# EasyEDA Pro project Motores.epro, board PCB2
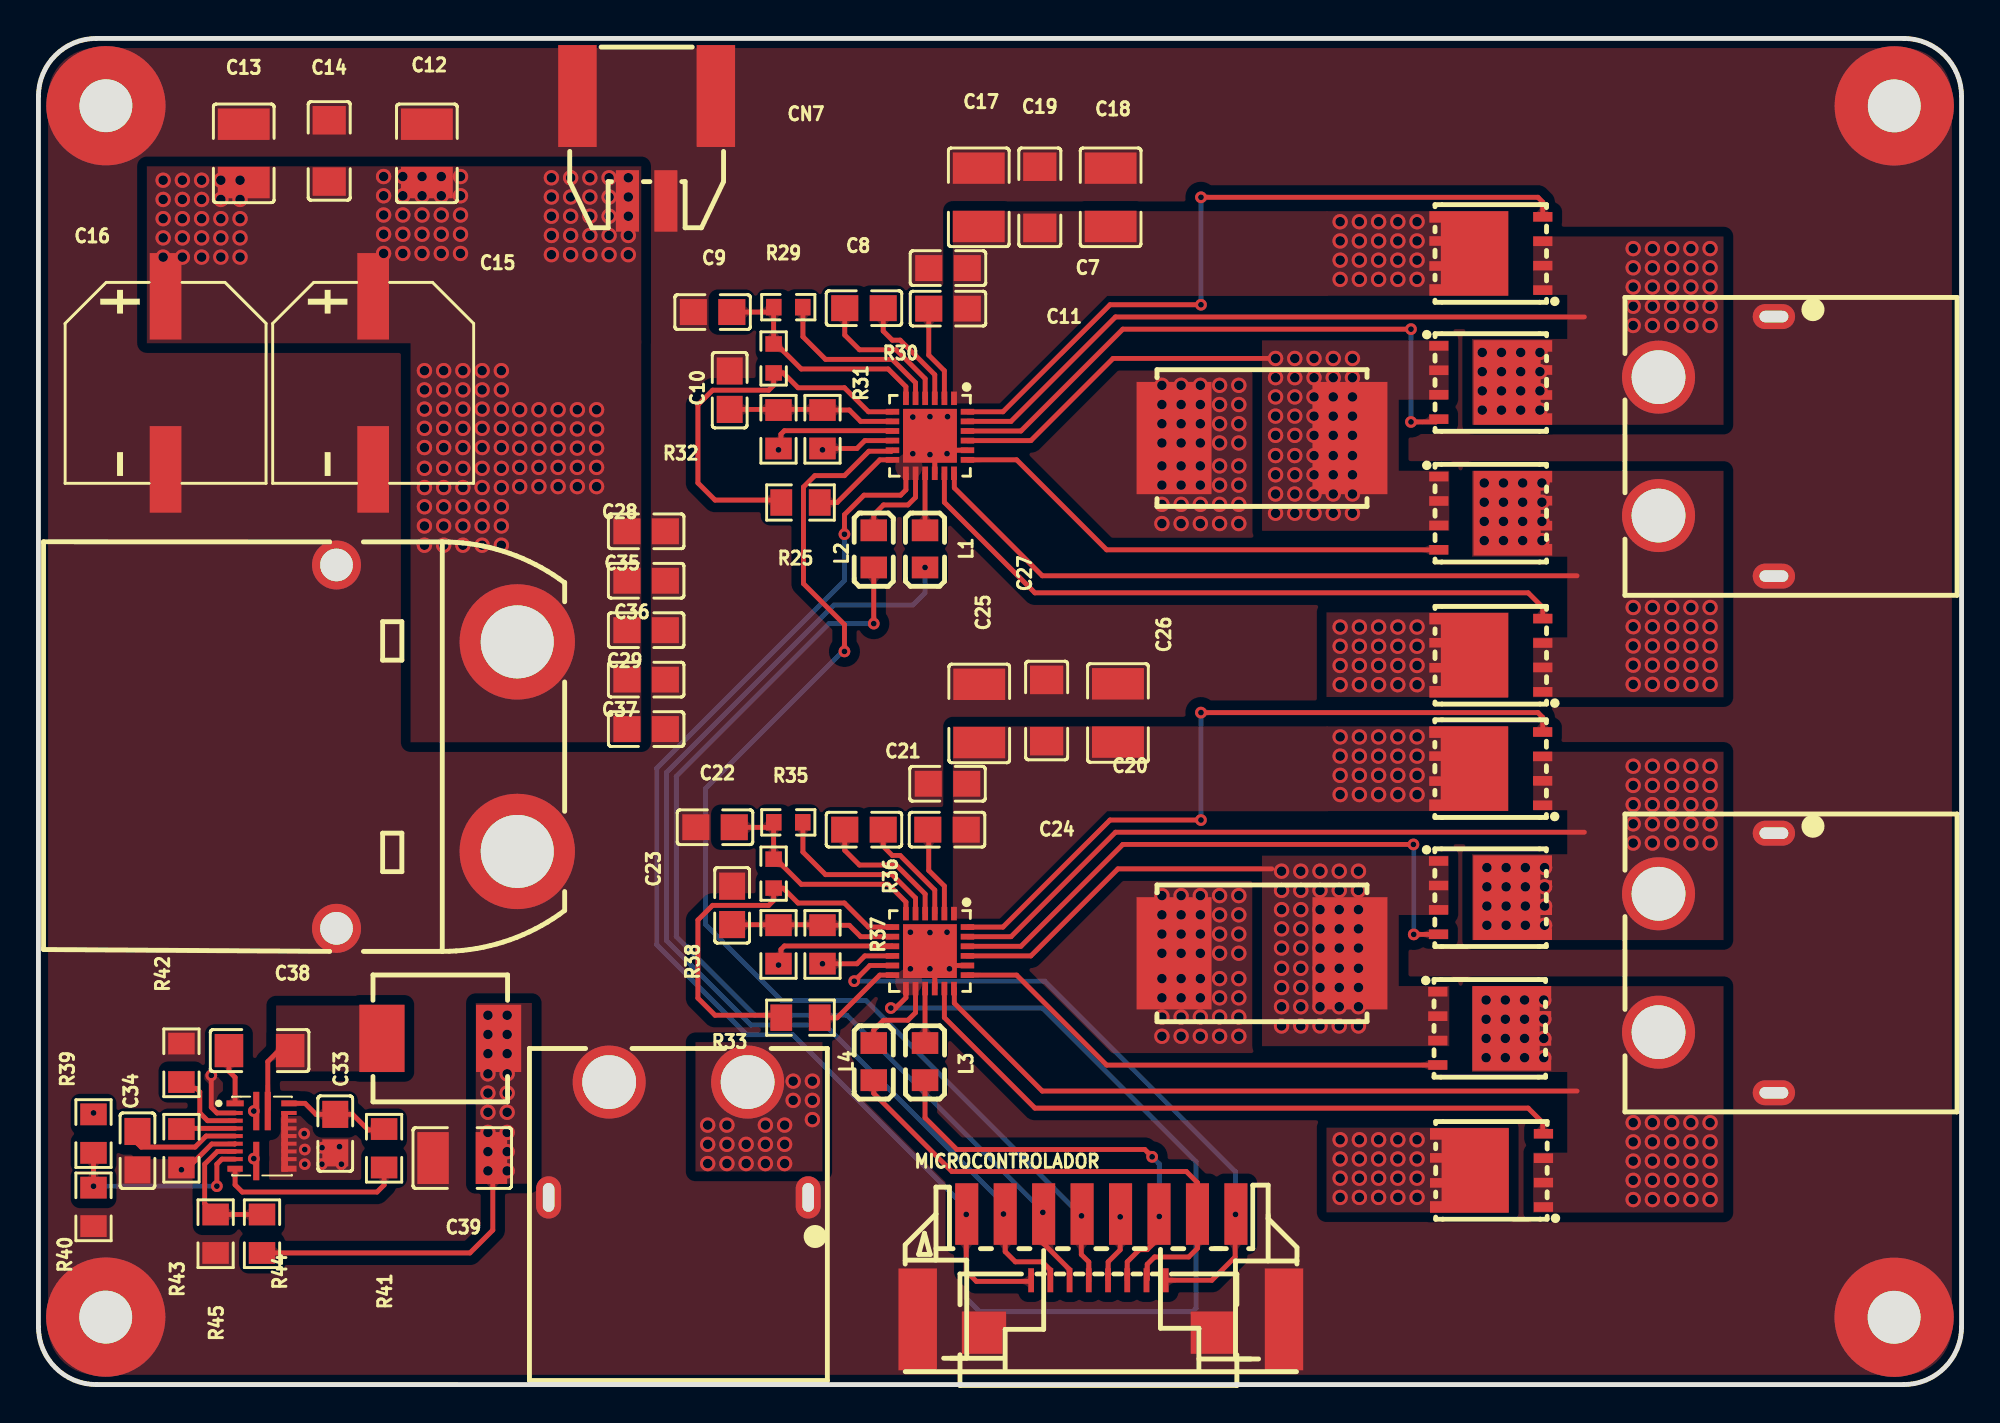
[diagram p1: board, top side]
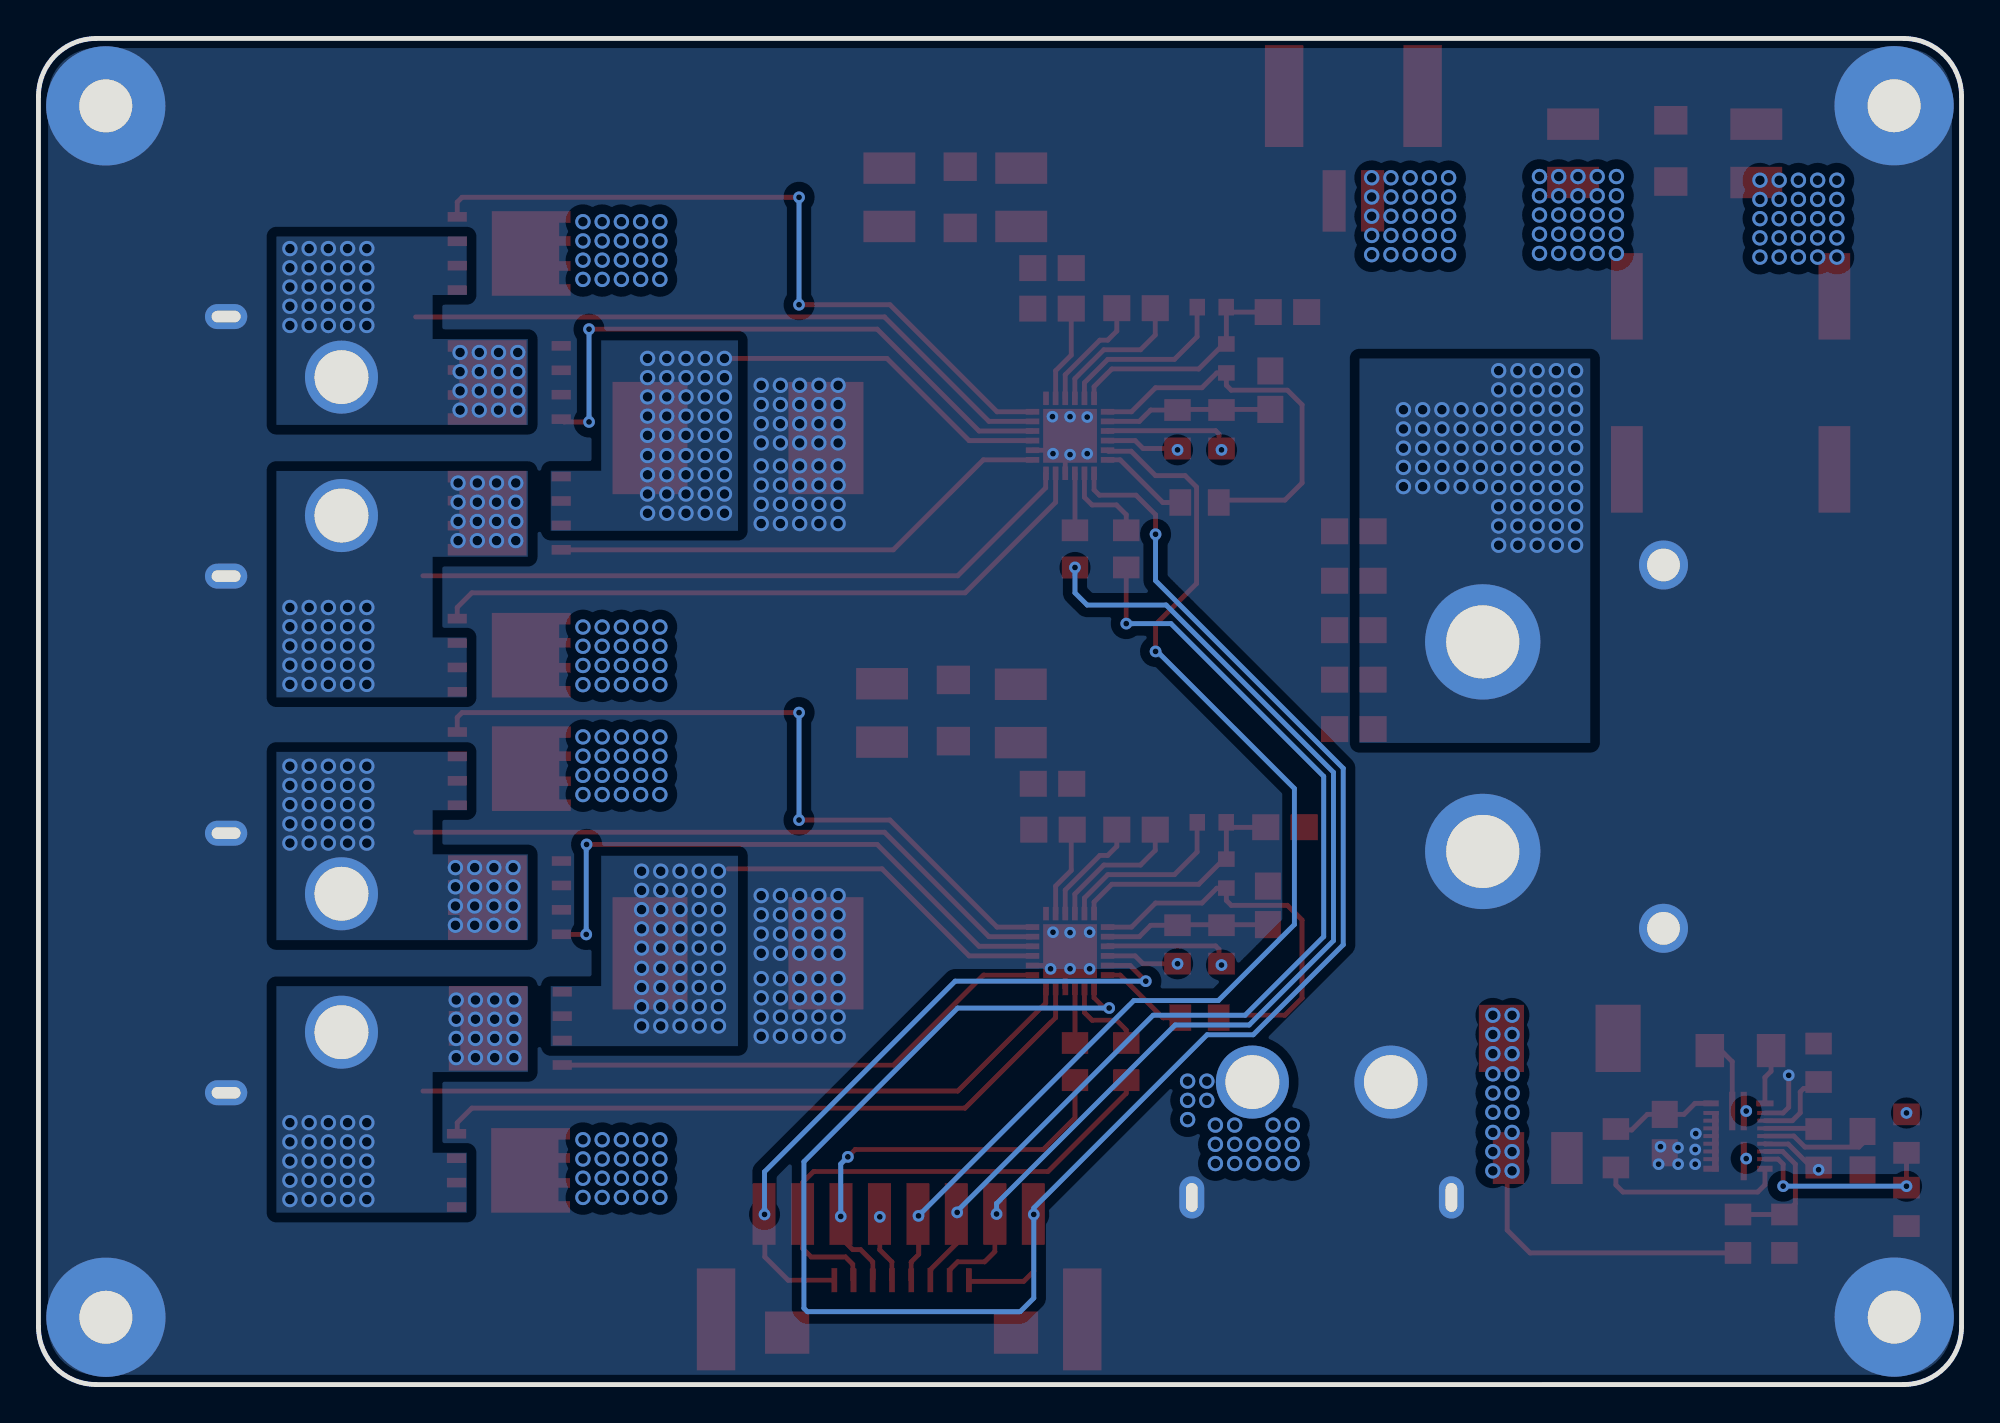
[diagram p2: board, bottom side, seen from below]

Outline 100.02 x 70.02 mm; copper layers: Top Layer, GND, PWR, Bottom Layer. Coordinates in mm from the lower left corner of the outline.
Outline path: 0,67.02 arc(0.88,69.14) 3.01,70.02 97.02,70.02 arc(99.14,69.13) 100.02,67.01 100.02,3 arc(99.13,0.88) 97.01,0 3,0 arc(0.88,0.88) 0,3.01 0,67.02
Stack: Top Layer 0.035mm Outer layer thickness 1oz / Dielectric1 0.2104mm 7628 RC49% 8.6mil / GND 0.0152mm Inner layer thickness / Dielectric2 1.065mm 1.1mm H/HOZ Copper / PWR 0.0152mm Inner layer thickness / Dielectric3 0.2104mm 7628 RC49% 8.6mil / Bottom Layer 0.035mm Outer layer thickness 1oz

## Design rules (mm)
template: Custom Config
spacing copperThickness1oz (default): track to track 0.102, other pairs 0.152 to 0.3
spacing copperThickness2oz: track to track 0.203, other pairs 0.152 to 0.3
track width copperThickness1oz (default): min 0.127, default 0.254, max 3
track width copperThickness2oz: min 0.203, default 0.254, max 2.54
differential pair differentialPair (default): width min 0.127, default 0.254, max 2.54; gap min 0.152, default 0.152
via viaSize (default): diameter min 0.5, default 0.61, max 10; hole min 0.3, default 0.305, max 6.3

## Placement (name value [footprint] x y rotation side)
C7  100nF  [C0805]  47.3 58.07 180 top
C8  100nF  [C0805]  42.93 55.99 180 top
C9  1uF  [C0805]  35.06 55.79 0 top
C10  1uF  [C0805]  35.95 51.72 270 top
C11  1uF  [C0805]  47.3 55.96 0 top
C12  22uF  [C1210]  20.2 64.04 90 top
C13  22uF  [C1210]  10.68 64.04 90 top
C14  100nF  [C1206]  15.12 64.17 270 top
C15  1000uF  [CAP-SMD_BD10.0-L10.3-W10.3-FD]  17.41 52.1 270 top
C16  1000uF  [CAP-SMD_BD10.0-L10.3-W10.3-FD]  6.61 52.1 270 top
C17  22uF  [C1210]  48.9 61.76 90 top
C18  22uF  [C1210]  55.76 61.76 90 top
C19  100nF  [C1206]  52.08 61.76 270 top
C20  100nF  [C0805]  47.28 31.25 180 top
C21  100nF  [C0805]  42.93 28.86 180 top
C22  1uF  [C0805]  35.19 28.99 0 top
C23  1uF  [C0805]  36.08 24.93 270 top
C24  1uF  [C0805]  47.25 28.86 0 top
C25  22uF  [C1210]  48.93 34.91 90 top
C26  22uF  [C1210]  56.14 34.93 90 top
C27  100nF  [C1206]  52.43 35.06 270 top
C28  4.7uF  [C0805]  31.61 44.38 180 top
C29  4.7uF  [C0805]  31.61 36.67 180 top
C33  2.2uF  [C0805]  15.44 13.05 90 top
C34  82nF  [C0805]  5.15 12.16 90 top
C35  1uF  [C0805]  31.61 41.81 180 top
C36  1uF  [C0805]  31.61 39.24 180 top
C37  1uF  [C0805]  31.61 34.09 180 top
C38  100nF  [C1206]  11.5 17.37 180 top
C39  100uF  [C1210]  22.04 11.78 0 top
CN6  BATERIA  [CONN-TH_XT90PW-M.G.Y]  20.2 33.18 90 top
CN7  5023520201  [CONN-SMD_2P-P2.00_MOLEX_5023520201]  31.63 64.3 180 top
FPC1  AFA01-S08FCA-00  [FPC-SMD_8P-P1.00_FGS-XJ-H2.0]  55.13 4.06 180 top
L1  BLM21RK221SN1D  [L0805]  46.11 43.47 90 top
L2  BLM21RK221SN1D  [L0805]  43.44 43.47 90 top
L3  BLM21RK221SN1D  [L0805]  46.11 16.8 90 top
L4  BLM21RK221SN1D  [L0805]  43.44 16.8 90 top
MICROCONTROLADOR  5023520800  [CONN-SMD_5023520800]  55.25 6.13 0 top
NOREF  -  [Pad_e746]  96.51 3.5 180 top
NOREF#2  -  [Pad_e748]  3.5 3.51 90 top
NOREF#3  -  [Pad_e744]  96.52 66.51 270 top
NOREF#4  -  [Pad_e742]  3.51 66.52 0 top
Q10  BSC014N06NS  [POWERVDFN-8_L6.2-W5.2-P1.27-LS6.0-BL]  76.46 58.83 90 top
Q11  BSC014N06NS  [POWERVDFN-8_L6.2-W5.2-P1.27-LS6.0-BL]  74.6 52.12 270 top
Q12  BSC014N06NS  [POWERVDFN-8_L6.2-W5.2-P1.27-LS6.0-BL]  74.6 45.32 270 top
Q13  BSC014N06NS  [POWERVDFN-8_L6.2-W5.2-P1.27-LS6.0-BL]  76.46 37.94 90 top
Q14  BSC014N06NS  [POWERVDFN-8_L6.2-W5.2-P1.27-LS6.0-BL]  76.46 32.04 90 top
Q15  BSC014N06NS  [POWERVDFN-8_L6.2-W5.2-P1.27-LS6.0-BL]  74.59 25.33 270 top
Q16  BSC014N06NS  [POWERVDFN-8_L6.2-W5.2-P1.27-LS6.0-BL]  74.55 18.53 270 top
Q17  BSC014N06NS  [POWERVDFN-8_L6.2-W5.2-P1.27-LS6.0-BL]  76.5 11.14 90 top
R25  68kΩ  [R0805]  39.63 45.88 0 top
R26  5mΩ  [RES-SMD_L11.6-W7.0_WSR5]  63.64 49.23 0 top
R29  56kΩ  [R0603]  39 56.04 0 top
R30  44.2kΩ  [R0603]  38.23 53.37 90 top
R31  10kΩ  [R0805]  40.77 49.69 90 top
R32  10kΩ  [R0805]  38.49 49.69 90 top
R33  68kΩ  [R0805]  39.63 19.08 0 top
R34  5mΩ  [RES-SMD_L11.6-W7.0_WSR5]  63.64 22.43 0 top
R35  56kΩ  [R0603]  39 29.24 0 top
R36  44.2kΩ  [R0603]  38.23 26.58 90 top
R37  10kΩ  [R0805]  40.77 22.89 90 top
R38  10kΩ  [R0805]  38.49 22.89 90 top
R39  66.5kΩ  [R0805]  2.86 13.05 90 top
R40  10kΩ  [R0805]  2.86 9.24 90 top
R41  30.1kΩ  [R0805]  17.98 12.29 90 top
R42  4.87kΩ  [R0805]  7.44 16.74 270 top
R43  30.1kΩ  [R0805]  7.44 12.29 90 top
R44  45.3kΩ  [R0805]  11.63 7.85 270 top
R45  10kΩ  [R0805]  9.21 7.85 90 top
U13  DRV8701PRGER  [VQFN-24_L4.0-W4.0-P0.50-BL-EP2.8]  46.37 49.35 180 top
U16  DRV8701PRGER  [VQFN-24_L4.0-W4.0-P0.50-BL-EP2.8]  46.36 22.55 180 top
U17  MOTOR IZQUIERDO  [TH_2P-XT60PW-F]  87.26 48.8 270 top
U18  MOTOR DERECHO  [TH_2P-XT60PW-F]  87.26 21.93 270 top
U19  TPS54JA20RWWR  [TQFN-21_L4.0-W3.0-P0.40-TL_MPQ8633BGLE-Z]  11.63 12.93 0 top
U20  1.2uH  [IND-SMD_L7.0-W6.6_0630CDMCCDS]  20.9 18.01 0 top
U21  SALIDA 5V  [TH_2P-XT60PW-F]  33.28 12.73 180 top

## Footprints (pads in the part's own frame, mm; a bottom-side part is the same pattern mirrored in y, then rotated)
C0805
  rect 1.41x1.35 smd: 1(-1,0) 2(1,0)
C1206
  rect 1.485x1.728 smd: 1(-1.593,0) 2(1.593,0)
C1210
  rect 1.635x2.7 smd: 1(-1.518,0) 2(1.518,0)
CAP-SMD_BD10.0-L10.3-W10.3-FD
  rect 4.5x1.65 smd: 1(-4.5,0) 2(4.5,0)
CONN-SMD_2P-P2.00_MOLEX_5023520201
  rect 1.2x3.2 smd: 1(1,2.728) 2(-1,2.728)
  rect 2x5.3 smd: 3(-3.6,-2.728) 4(3.6,-2.728)
CONN-SMD_5023520800
  rect 1.2x3.2 smd: 1(-6.975,2.74) 2(-4.975,2.74) 3(-2.975,2.74) 4(-0.975,2.74) 5(1.025,2.74) 6(3.025,2.74) 7(5.025,2.74) 8(7.025,2.74)
  rect 2x5.3 smd: 9(9.525,-2.74) 10(-9.525,-2.74)
CONN-TH_XT90PW-M.G.Y
  round 6 hole 3.8: 1(-5.45,-4.7) 2(5.45,-4.7)
  round 2.55 hole 1.7: 3(9.45,4.7) 4(-9.45,4.7)
FPC-SMD_8P-P1.00_FGS-XJ-H2.0
  rect 0.3x1.25 smd: 1(-3.5,-1.363) 2(-2.5,-1.363) 3(-1.5,-1.363) 4(-0.5,-1.363) 5(0.5,-1.363) 6(1.5,-1.363) 7(2.5,-1.363) 8(3.5,-1.363)
  rect 2.3x2.2 smd: 9(-5.95,1.363) 10(5.95,1.363)
IND-SMD_L7.0-W6.6_0630CDMCCDS
  rect 2.35x3.5 smd: 1(-3.035,0) 2(3.035,0)
L0805
  rect 1.133x1.377 smd: 1(-0.966,0) 2(0.966,0)
Pad_e742
  round 6.2 hole 2.75: 2(0,0)
Pad_e744
  round 6.2 hole 2.75: 2(0,0)
Pad_e746
  round 6.2 hole 2.75: 2(0,0)
Pad_e748
  round 6.2 hole 2.75: 2(0,0)
POWERVDFN-8_L6.2-W5.2-P1.27-LS6.0-BL
  rect 0.5x1 smd: 1(-1.905,-1.775) 2(-0.635,-1.775) 3(0.635,-1.775) 4(1.905,-1.775)
  custom 4.4x4.1 smd: 5(0,1.775)
R0603
  rect 0.806x0.864 smd: 1(-0.753,0) 2(0.753,0)
R0805
  rect 1.133x1.377 smd: 1(-1,0) 2(1,0)
RES-SMD_L11.6-W7.0_WSR5
  rect 3.9x5.84 smd: 1(-4.575,0) 2(4.575,0)
TH_2P-XT60PW-F
  oval 1.3x2.2 hole 0.6x1.5: 1(-6.75,3) 2(6.75,3)
  round 3.8 hole 2.8: 3(-3.6,-3) 4(3.6,-3)
TQFN-21_L4.0-W3.0-P0.40-TL_MPQ8633BGLE-Z
  rect 0.9x0.31 smd: 1(-1.4,1.7)
  rect 0.8x0.21 smd: 2(-1.4,1.2) 3(-1.4,0.8) 4(-1.4,0.4) 5(-1.4,0) 6(-1.4,-0.4) 7(-1.4,-0.8) 8(-1.4,-1.2) 12(1.4,-1.2) 13(1.4,-0.8) 14(1.4,-0.4) 15(1.4,0) 16(1.4,0.4) 17(1.4,0.8) 18(1.4,1.2)
  rect 0.8x0.31 smd: 9(-1.4,-1.7) 11(1.4,-1.7) 19(1.4,1.7)
  rect 0.32x2 smd: 10(-0.3,-1.3) 20(0.3,1.3) 21(-0.3,1.3)
  rect 0.35x3.15 smd: 11(1.175,-0.275)
VQFN-24_L4.0-W4.0-P0.50-BL-EP2.8
  rect 0.3x0.7 smd: 1(-1.25,-1.95) 2(-0.75,-1.95) 3(-0.25,-1.95) 4(0.25,-1.95) 5(0.75,-1.95) 6(1.25,-1.95) 13(1.25,1.95) 14(0.75,1.95) 15(0.25,1.95) 16(-0.25,1.95) 17(-0.75,1.95) 18(-1.25,1.95)
  rect 0.7x0.3 smd: 7(1.95,-1.25) 8(1.95,-0.75) 9(1.95,-0.25) 10(1.95,0.25) 11(1.95,0.75) 12(1.95,1.25) 19(-1.95,1.25) 20(-1.95,0.75) 21(-1.95,0.25) 22(-1.95,-0.25) 23(-1.95,-0.75) 24(-1.95,-1.25)
  rect 2.8x2.8 smd: 25(0,0)

## Nets
As in the schematic, except:
GND: C7.2 C9.1 C10.1 C12.2 C13.2 C14.1 C15.2 C16.2 C17.2 C18.2 C19.1 C20.2 C22.1 C23.1 C25.2 C26.2 C27.1 C28.1 C29.1 C33.1 C34.1 C35.1 C36.1 C37.1 C39.1 CN6.1 CN6.3 CN6.4 CN7.2 CN7.3 CN7.4 FPC1.9 FPC1.10 MICROCONTROLADOR.9 MICROCONTROLADOR.10 NOREF.2 NOREF#2.2 NOREF#3.2 NOREF#4.2 R26.1 R34.1 R40.1 R42.1 R43.1 R45.1 U13.16 U13.20 U13.25 U16.16 U16.20 U16.25 U17.1 U17.2 U18.1 U18.2 U19.2 U19.6 U19.11 U19.12 U19.13 U19.14 U19.15 U19.16 U19.17 U19.18 U21.1 U21.2 U21.4
VCC: C7.1 C11.2 C12.1 C13.1 C14.2 C15.1 C16.1 C17.1 C18.1 C19.2 C20.1 C24.2 C25.1 C26.1 C27.2 C28.2 C29.2 C35.2 C36.2 C37.2 CN6.2 CN7.1 FPC1.4 MICROCONTROLADOR.5 Q10.5 Q13.5 Q14.5 Q17.5 R39.2 U13.1 U16.1 U19.10 U19.21
CURRL: FPC1.5 MICROCONTROLADOR.4 U13.11
CURRR: FPC1.1 MICROCONTROLADOR.8 U16.11
ENABLE: FPC1.8 MICROCONTROLADOR.1 U13.13 U16.13
PWML1: FPC1.7 L1.1 MICROCONTROLADOR.2
PWML2: FPC1.6 L2.1 MICROCONTROLADOR.3
PWMR1: FPC1.3 L3.1 MICROCONTROLADOR.6
PWMR2: FPC1.2 L4.1 MICROCONTROLADOR.7

## Via types
v1: diameter 0.8, hole 0.5, Top Layer to Bottom Layer, 601 vias
v2: diameter 0.61, hole 0.305, Top Layer to Bottom Layer, 52 vias

## Routing (per net, layer and track width the routed paths; a pad name or vN(x,y) marks a point on that pad's centre or on a via; arc(x,y) is an arc through that point)
+5V: length 16.3
  Top Layer w0.254: R44.2 22.44,6.85 23.63,8.03 23.63,11.6 23.81,11.78
  vias: v1(23.38,19.21) v1(23.38,18.21) v1(23.38,17.21) v1(23.38,16.16) v1(23.38,15.16) v1(23.38,14.16) v1(23.38,13.11) v1(23.38,12.11) v1(23.38,11.11) v1(24.38,19.21) v1(24.38,18.21) v1(24.38,17.21) v1(24.38,16.16) v1(24.38,15.16) v1(24.38,14.16) v1(24.38,13.11) v1(24.38,12.11) v1(24.38,11.11) v1(34.81,13.5) v1(34.81,12.5) v1(34.81,11.5) v1(35.81,13.5) v1(35.81,12.5) v1(35.81,11.5) v1(36.81,12.5) v1(36.81,11.5) v1(37.81,13.5) v1(37.81,12.5) v1(37.81,11.5) v1(38.81,13.5) v1(38.81,12.5) v1(38.81,11.5) v1(39.25,15.78) v1(39.25,14.78) v1(40.25,15.78) v1(40.25,14.78) v1(40.25,13.78)
GND: length 12.6
  Top Layer w0.254: U19.6 10.21,12.51 9.01,12.51 7.8,11.29 R43.1 ; U19.2 9.28,14.13 8.99,14.42 v2(8.99,16.09) ; U16.20 47.55,21.8 v2(47.38,21.62) ; U13.16 46.62,49.1 U13.25 ; U16.16 46.61,22.3 U16.25 ; v2(47.25,48.42) 47.43,48.6 U13.20
  vias: v1(58.43,51.98) v1(58.43,50.98) v1(58.43,49.98) v1(58.43,48.98) v1(58.43,47.79) v1(58.43,46.79) v1(58.43,45.79) v1(58.43,44.79) v1(58.43,25.43) v1(58.43,24.43) v1(58.43,23.43) v1(58.43,22.43) v1(58.43,21.12) v1(58.43,20.12) v1(58.43,19.12) v1(58.43,18.12) v1(59.43,51.98) v1(59.43,50.98) v1(59.43,49.98) v1(59.43,48.98) v1(59.43,47.79) v1(59.43,46.79) v1(59.43,45.79) v1(59.43,44.79) v1(59.43,25.43) v1(59.43,24.43) v1(59.43,23.43) v1(59.43,22.43) v1(59.43,21.12) v1(59.43,20.12) v1(59.43,19.12) v1(59.43,18.12) v1(60.43,51.98) v1(60.43,50.98) v1(60.43,49.98) v1(60.43,48.98) v1(60.43,47.79) v1(60.43,46.79) v1(60.43,45.79) v1(60.43,44.79) v1(60.43,25.43) v1(60.43,24.43) v1(60.43,23.43) v1(60.43,22.43) v1(60.43,21.12) v1(60.43,20.12) v1(60.43,19.12) v1(60.43,18.12) v1(61.43,51.98) v1(61.43,50.98) v1(61.43,49.98) v1(61.43,48.98) v1(61.43,47.79) v1(61.43,46.79) v1(61.43,45.79) v1(61.43,44.79) v1(61.43,25.43) v1(61.43,24.43) v1(61.43,23.43) v1(61.43,22.43) v1(61.43,21.12) v1(61.43,20.12) v1(61.43,19.12) v1(61.43,18.12) v1(62.43,51.98) v1(62.43,50.98) v1(62.43,49.98) v1(62.43,48.98) v1(62.43,47.79) v1(62.43,46.79) v1(62.43,45.79) v1(62.43,44.79) v1(62.43,25.43) v1(62.43,24.43) v1(62.43,23.43) v1(62.43,22.43) v1(62.43,21.12) v1(62.43,20.12) v1(62.43,19.12) v1(62.43,18.12) v2(7.44,11.17) v2(13.82,13.05) v2(13.85,12.23) v2(13.85,11.46) v2(14.75,12.32) v2(14.74,11.46) v2(15.66,12.37) v2(15.76,11.46) v2(45.35,23.53) v2(45.35,21.62) v2(45.47,50.33) v2(45.47,48.42) v2(46.37,50.35) v2(46.37,48.37) v2(46.36,23.51) v2(46.36,21.63) v2(47.25,23.53) v2(47.28,50.35)
VCC: length 3.7
  Top Layer w0.254: U19.10 v2(11.2,11.75) ; v2(56.26,8.72) 56.26,7.01 55.63,6.38 55.63,5.43 FPC1.4
  vias: v1(6.48,62.64) v1(6.48,61.64) v1(6.48,60.64) v1(6.48,59.64) v1(6.48,58.64) v1(7.48,62.64) v1(7.48,61.64) v1(7.48,60.64) v1(7.48,59.64) v1(7.48,58.64) v1(8.48,62.64) v1(8.48,61.64) v1(8.48,60.64) v1(8.48,59.64) v1(8.48,58.64) v1(9.48,62.64) v1(9.48,61.64) v1(9.48,60.64) v1(9.48,59.64) v1(9.48,58.64) v1(10.48,62.64) v1(10.48,61.64) v1(10.48,60.64) v1(10.48,59.64) v1(10.48,58.64) v1(17.95,62.84) v1(17.95,61.84) v1(17.95,60.84) v1(17.95,59.84) v1(17.95,58.84) v1(18.95,62.84) v1(18.95,61.84) v1(18.95,60.84) v1(18.95,59.84) v1(18.95,58.84) v1(19.95,62.84) v1(19.95,61.84) v1(19.95,60.84) v1(19.95,59.84) v1(19.95,58.84) v1(20.07,52.74) v1(20.07,51.74) v1(20.07,50.74) v1(20.07,49.74) v1(20.07,48.74) v1(20.07,47.66) v1(20.07,46.66) v1(20.07,45.66) v1(20.07,44.66) v1(20.07,43.66) v1(20.95,62.84) v1(20.95,61.84) v1(20.95,60.84) v1(20.95,59.84) v1(20.95,58.84) v1(21.07,52.74) v1(21.07,51.74) v1(21.07,50.74) v1(21.07,49.74) v1(21.07,48.74) v1(21.07,47.66) v1(21.07,46.66) v1(21.07,45.66) v1(21.07,44.66) v1(21.07,43.66) v1(21.95,62.84) v1(21.95,61.84) v1(21.95,60.84) v1(21.95,59.84) v1(21.95,58.84) v1(22.07,52.74) v1(22.07,51.74) v1(22.07,50.74) v1(22.07,49.74) v1(22.07,48.74) v1(22.07,47.66) v1(22.07,46.66) v1(22.07,45.66) v1(22.07,44.66) v1(22.07,43.66) v1(23.07,52.74) v1(23.07,51.74) v1(23.07,50.74) v1(23.07,49.74) v1(23.07,48.74) v1(23.07,47.66) v1(23.07,46.66) v1(23.07,45.66) v1(23.07,44.66) v1(23.07,43.66) v1(24.07,52.74) v1(24.07,51.74) v1(24.07,50.74) v1(24.07,49.74) v1(24.07,48.74) v1(24.07,47.66) v1(24.07,46.66) v1(24.07,45.66) v1(24.07,44.66) v1(24.07,43.66) v1(25.03,50.71) v1(25.03,49.71) v1(25.03,48.71) v1(25.03,47.71) v1(25.03,46.71) v1(26.03,50.71) v1(26.03,49.71) v1(26.03,48.71) v1(26.03,47.71) v1(26.03,46.71) v1(26.68,62.77) v1(26.68,61.77) v1(26.68,60.77) v1(26.68,59.77) v1(26.68,58.77) v1(27.03,50.71) v1(27.03,49.71) v1(27.03,48.71) v1(27.03,47.71) v1(27.03,46.71) v1(27.68,62.77) v1(27.68,61.77) v1(27.68,60.77) v1(27.68,59.77) v1(27.68,58.77) v1(28.03,50.71) v1(28.03,49.71) v1(28.03,48.71) v1(28.03,47.71) v1(28.03,46.71) v1(28.68,62.77) v1(28.68,61.77) v1(28.68,60.77) v1(28.68,59.77) v1(28.68,58.77) v1(29.03,50.71) v1(29.03,49.71) v1(29.03,48.71) v1(29.03,47.71) v1(29.03,46.71) v1(29.68,62.77) v1(29.68,61.77) v1(29.68,60.77) v1(29.68,59.77) v1(29.68,58.77) v1(30.68,62.77) v1(30.68,61.77) v1(30.68,60.77) v1(30.68,59.77) v1(30.68,58.77) v1(67.7,60.49) v1(67.7,59.49) v1(67.7,58.49) v1(67.7,57.49) v1(67.7,39.4) v1(67.7,38.4) v1(67.7,37.4) v1(67.7,36.4) v1(67.7,33.69) v1(67.7,32.69) v1(67.7,31.69) v1(67.7,30.69) v1(67.7,12.73) v1(67.7,11.73) v1(67.7,10.73) v1(67.7,9.73) v1(68.7,60.49) v1(68.7,59.49) v1(68.7,58.49) v1(68.7,57.49) v1(68.7,39.4) v1(68.7,38.4) v1(68.7,37.4) v1(68.7,36.4) v1(68.7,33.69) v1(68.7,32.69) v1(68.7,31.69) v1(68.7,30.69) v1(68.7,12.73) v1(68.7,11.73) v1(68.7,10.73) v1(68.7,9.73) v1(69.7,60.49) v1(69.7,59.49) v1(69.7,58.49) v1(69.7,57.49) v1(69.7,39.4) v1(69.7,38.4) v1(69.7,37.4) v1(69.7,36.4) v1(69.7,33.69) v1(69.7,32.69) v1(69.7,31.69) v1(69.7,30.69) v1(69.7,12.73) v1(69.7,11.73) v1(69.7,10.73) v1(69.7,9.73) v1(70.7,60.49) v1(70.7,59.49) v1(70.7,58.49) v1(70.7,57.49) v1(70.7,39.4) v1(70.7,38.4) v1(70.7,37.4) v1(70.7,36.4) v1(70.7,33.69) v1(70.7,32.69) v1(70.7,31.69) v1(70.7,30.69) v1(70.7,12.73) v1(70.7,11.73) v1(70.7,10.73) v1(70.7,9.73) v1(71.7,60.49) v1(71.7,59.49) v1(71.7,58.49) v1(71.7,57.49) v1(71.7,39.4) v1(71.7,38.4) v1(71.7,37.4) v1(71.7,36.4) v1(71.7,33.69) v1(71.7,32.69) v1(71.7,31.69) v1(71.7,30.69) v1(71.7,12.73) v1(71.7,11.73) v1(71.7,10.73) v1(71.7,9.73) v2(2.86,14.13) v2(11.2,14.23)
CURRL: length 61.5
  Top Layer w0.254: U13.11 44.36,48.55 43.19,48.55 41.92,47.28 40.38,47.28 39.79,46.68 39.79,41.66 41.92,39.53 v2(41.92,38.13) ; v2(54.25,8.77) 54.24,8.76 54.24,6.76 54.63,6.38 FPC1.5
  Bottom Layer w0.254: 41.94,38.24 34.7,31 34.7,23.93 38.65,19.97 43.05,19.97 v2(54.25,8.77)
CURRR: length 34.8
  Top Layer w0.254: FPC1.1 61.03,5.43 62.24,6.64 62.24,8.83 v2(62.26,8.85) ; v2(42.43,20.98) 43.24,21.8 44.41,21.8
  Bottom Layer w0.254: v2(62.26,8.85) 62.26,11.07 52.34,20.98 v2(42.43,20.98)
ENABLE: length 104.6
  Top Layer w0.254: v2(44.33,19.59) 44.58,19.59 45.11,20.12 U16.13 ; v2(41.92,44.23) 41.92,45.25 42.93,46.26 44.84,46.26 45.12,46.54 U13.13 ; FPC1.8 51.57,5.37 48.78,5.37 48.25,5.89 v2(48.25,8.85)
  Bottom Layer w0.254: v2(44.33,19.59) 52.21,19.59 60.21,11.59 60.21,3.97 60.03,3.79 48.96,3.79 48.25,4.5 v2(48.25,8.85) 48.25,9.18 39.24,18.19 36.84,18.19 32.16,22.88 32.16,32.06 41.92,41.82 v2(41.92,44.23)
MOTL1: length 34.3
  Top Layer w0.254: U13.23 50.58,50.1 56.02,55.53 80.4,55.53
  vias: v1(75.09,53.69) v1(75.09,52.69) v1(75.09,51.69) v1(75.09,50.69) v1(76.09,53.69) v1(76.09,52.69) v1(76.09,51.69) v1(76.09,50.69) v1(77.09,53.69) v1(77.09,52.69) v1(77.09,51.69) v1(77.09,50.69) v1(78.09,53.69) v1(78.09,52.69) v1(78.09,51.69) v1(78.09,50.69) v1(82.94,59.09) v1(82.94,58.09) v1(82.94,57.09) v1(82.94,56.09) v1(82.94,55.09) v1(83.94,59.09) v1(83.94,58.09) v1(83.94,57.09) v1(83.94,56.09) v1(83.94,55.09) v1(84.94,59.09) v1(84.94,58.09) v1(84.94,57.09) v1(84.94,56.09) v1(84.94,55.09) v1(85.94,59.09) v1(85.94,58.09) v1(85.94,57.09) v1(85.94,56.09) v1(85.94,55.09) v1(86.94,59.09) v1(86.94,58.09) v1(86.94,57.09) v1(86.94,56.09) v1(86.94,55.09)
MOTL2: length 35
  Top Layer w0.254: 80.02,42.07 52.2,42.07 47.63,46.64 47.63,47.38 U13.18
  vias: v1(75.19,46.9) v1(75.19,45.9) v1(75.19,44.9) v1(75.19,43.9) v1(76.19,46.9) v1(76.19,45.9) v1(76.19,44.9) v1(76.19,43.9) v1(77.19,46.9) v1(77.19,45.9) v1(77.19,44.9) v1(77.19,43.9) v1(78.19,46.9) v1(78.19,45.9) v1(78.19,44.9) v1(78.19,43.9) v1(82.94,40.42) v1(82.94,39.42) v1(82.94,38.42) v1(82.94,37.42) v1(82.94,36.42) v1(83.94,40.42) v1(83.94,39.42) v1(83.94,38.42) v1(83.94,37.42) v1(83.94,36.42) v1(84.94,40.42) v1(84.94,39.42) v1(84.94,38.42) v1(84.94,37.42) v1(84.94,36.42) v1(85.94,40.42) v1(85.94,39.42) v1(85.94,38.42) v1(85.94,37.42) v1(85.94,36.42) v1(86.94,40.42) v1(86.94,39.42) v1(86.94,38.42) v1(86.94,37.42) v1(86.94,36.42)
MOTR1: length 34.3
  Top Layer w0.254: 80.4,28.73 56.01,28.73 50.58,23.3 U16.23
  vias: v1(75.33,26.89) v1(75.33,25.89) v1(75.33,24.89) v1(75.33,23.89) v1(76.33,26.89) v1(76.33,25.89) v1(76.33,24.89) v1(76.33,23.89) v1(77.33,26.89) v1(77.33,25.89) v1(77.33,24.89) v1(77.33,23.89) v1(78.33,26.89) v1(78.33,25.89) v1(78.33,24.89) v1(78.33,23.89) v1(82.94,32.16) v1(82.94,31.16) v1(82.94,30.16) v1(82.94,29.16) v1(82.94,28.16) v1(83.94,32.16) v1(83.94,31.16) v1(83.94,30.16) v1(83.94,29.16) v1(83.94,28.16) v1(84.94,32.16) v1(84.94,31.16) v1(84.94,30.16) v1(84.94,29.16) v1(84.94,28.16) v1(85.94,32.16) v1(85.94,31.16) v1(85.94,30.16) v1(85.94,29.16) v1(85.94,28.16) v1(86.94,32.16) v1(86.94,31.16) v1(86.94,30.16) v1(86.94,29.16) v1(86.94,28.16)
MOTR2: length 35
  Top Layer w0.254: U16.18 47.63,20.58 47.63,19.84 52.2,15.27 80.02,15.27
  vias: v1(75.29,20) v1(75.29,19) v1(75.29,18) v1(75.29,17) v1(76.29,20) v1(76.29,19) v1(76.29,18) v1(76.29,17) v1(77.29,20) v1(77.29,19) v1(77.29,18) v1(77.29,17) v1(78.29,20) v1(78.29,19) v1(78.29,18) v1(78.29,17) v1(82.94,13.62) v1(82.94,12.62) v1(82.94,11.62) v1(82.94,10.62) v1(82.94,9.62) v1(83.94,13.62) v1(83.94,12.62) v1(83.94,11.62) v1(83.94,10.62) v1(83.94,9.62) v1(84.94,13.62) v1(84.94,12.62) v1(84.94,11.62) v1(84.94,10.62) v1(84.94,9.62) v1(85.94,13.62) v1(85.94,12.62) v1(85.94,11.62) v1(85.94,10.62) v1(85.94,9.62) v1(86.94,13.62) v1(86.94,12.62) v1(86.94,11.62) v1(86.94,10.62) v1(86.94,9.62)
PWML1: length 56.4
  Top Layer w0.254: MICROCONTROLADOR.2 50.28,6.91 50.81,6.38 52.2,6.38 52.63,5.96 FPC1.7
  Bottom Layer w0.254: v2(46.11,42.5) 46.11,41.18 45.47,40.55 41.37,40.55 32.67,31.85 32.67,23.09 37.05,18.7 40.9,18.7 50.19,9.42 v2(50.19,8.87)
PWML2: length 53.9
  Top Layer w0.254: MICROCONTROLADOR.3 52.28,7.33 53.63,5.98 FPC1.6 ; L2.1 v2(43.44,39.58)
  Bottom Layer w0.254: v2(52.24,8.96) 52.24,9.02 42.05,19.21 37.26,19.21 33.17,23.3 33.17,31.63 41.12,39.58 v2(43.44,39.58)
PWMR1: length 22.2
  Top Layer w0.254: 46.11,15.83 46.11,13.88 47.76,12.23 57.54,12.23 v2(57.92,11.84) ; MICROCONTROLADOR.6 58.28,7.63 57.67,7.02 57.26,7.02 56.63,6.38 FPC1.3
  Bottom Layer w0.254: v2(58.29,8.74) 58.29,11.47 v2(57.92,11.84)
PWMR2: length 26.7
  Top Layer w0.254: 43.44,15.83 43.44,15.15 47.51,11.08 59.7,11.08 60.28,10.5 MICROCONTROLADOR.7 60.28,7.09 59.83,6.64 58.05,6.64 57.67,6.26 57.67,5.47 FPC1.2
$1N1542: length 20.8
  Top Layer w0.254: 38.23,52.61 38.23,51.98 37.98,51.72 35.06,51.72 34.3,50.96 34.3,46.9 35.19,46.01 38.51,46.01 R25.1 ; R30.1 38.73,52.62 39.51,51.85 41.92,51.85 43.17,50.6 U13.7
$1N1548: length 9.2
  Top Layer w0.254: 39.88,56.04 39.76,55.92 39.76,54.5 40.94,53.33 44.4,53.33 45.62,52.11 U13.5
$1N1553: length 12.5
  Top Layer w0.254: 38.31,55.98 38.37,56.04 ; 38.23,55.91 38.23,54.26 39.67,52.83 44.19,52.83 45.12,51.9 U13.6 ; R29.1 37.99,55.79 C9.2
$1N1568: length 4.7
  Top Layer w0.254: R25.2 41.54,45.88 43.76,48.1 44.42,48.1
$1N2215: length 8.9
  Top Layer w0.254: R31.2 40.99,50.69 ; 40.99,50.69 40.96,50.72 C10.2 ; 40.99,50.69 42.17,50.69 42.76,50.1 U13.8
$1N2263: length 6.7
  Top Layer w0.254: U13.9 44.4,49.62 38.8,49.62 38.62,49.44 38.62,48.82 R32.1
  vias: v2(38.49,48.62)
$1N2273: length 3.8
  Top Layer w0.254: 44.42,49.1 42.98,49.1 42.57,48.69 R31.1
  vias: v2(40.77,48.62)
$1N2281: length 6
  Top Layer w0.254: U13.3 46.62,52.53 44.81,54.33 44.41,54.33 43.93,54.8 C8.1
$1N2285: length 7.5
  Top Layer w0.254: U13.4 46.12,52.32 44.61,53.83 42.7,53.83 41.93,54.59 C8.2
$1N2295: length 5
  Top Layer w0.254: U13.2 47.12,52.73 46.3,53.55 C11.1
$1N2619: length 38.7
  Top Layer w0.254: v2(60.46,61.76) 77.99,61.76 78.24,61.5 Q10.4 ; v2(60.46,56.17) 55.73,56.17 50.16,50.6 U13.24
  Bottom Layer w0.254: v2(60.46,61.76) v2(60.46,56.17)
$1N2625: length 31.6
  Top Layer w0.254: U13.22 51.1,49.6 56.4,54.9 v2(71.38,54.9) ; v2(71.38,50.07) 72.68,50.07 Q11.4
  Bottom Layer w0.254: v2(71.38,54.9) v2(71.38,50.07)
$1N2752: length 17.8
  Top Layer w0.254: 48.32,49.1 51.61,49.1 55.89,53.37 v1(64.34,53.37)
  vias: v1(64.34,52.37) v1(64.34,51.37) v1(64.34,50.37) v1(64.34,49.37) v1(64.34,48.32) v1(64.34,47.32) v1(64.34,46.32) v1(64.34,45.32) v1(65.34,53.37) v1(65.34,52.37) v1(65.34,51.37) v1(65.34,50.37) v1(65.34,49.37) v1(65.34,48.32) v1(65.34,47.32) v1(65.34,46.32) v1(65.34,45.32) v1(66.34,53.37) v1(66.34,52.37) v1(66.34,51.37) v1(66.34,50.37) v1(66.34,49.37) v1(66.34,48.32) v1(66.34,47.32) v1(66.34,46.32) v1(66.34,45.32) v1(67.34,53.37) v1(67.34,52.37) v1(67.34,51.37) v1(67.34,50.37) v1(67.34,49.37) v1(67.34,48.32) v1(67.34,47.32) v1(67.34,46.32) v1(67.34,45.32) v1(68.34,53.37) v1(68.34,52.37) v1(68.34,51.37) v1(68.34,50.37) v1(68.34,49.37) v1(68.34,48.32) v1(68.34,47.32) v1(68.34,46.32) v1(68.34,45.32)
$1N2818: length 26.5
  Top Layer w0.254: 48.32,48.1 50.87,48.1 55.55,43.42 Q12.4
$1N2842: length 35.5
  Top Layer w0.254: U13.17 47.12,45.89 51.82,41.18 77.48,41.18 78.24,40.42 Q13.4
$1N3497: length 3
  Top Layer w0.254: 46.11,44.43 46.11,47.39 U13.15
$1N3553: length 4.6
  Top Layer w0.254: 43.44,44.43 43.44,45.25 43.95,45.75 45.22,45.75 45.62,46.15 U13.14
$1N4560: length 20.8
  Top Layer w0.254: 44.41,23.8 43.17,23.8 41.92,25.05 39.5,25.05 38.73,25.82 38.23,25.82 ; 38.23,25.82 38.23,25.18 37.98,24.93 35.06,24.93 34.3,24.16 34.3,20.1 35.19,19.21 38.51,19.21 R33.1 ; 38.23,25.82 R36.1
$1N4563: length 9.2
  Top Layer w0.254: U16.5 45.61,25.31 44.4,26.52 40.93,26.52 39.76,27.7 39.76,29.12 39.88,29.24
$1N4566: length 12.4
  Top Layer w0.254: 38.24,29.24 37.99,28.98 36.06,28.98 ; U16.6 45.11,25.1 44.19,26.02 39.67,26.02 38.23,27.46 38.23,29.1
$1N4571: length 4.7
  Top Layer w0.254: 40.63,19.08 41.54,19.08 43.76,21.3 44.41,21.3
$1N4574: length 8.7
  Top Layer w0.254: 44.41,23.3 42.76,23.3 42.17,23.89 40.99,23.89 40.96,23.92 35.95,23.92
$1N4592: length 6.7
  Top Layer w0.254: 44.41,22.8 44.4,22.81 38.8,22.81 38.62,22.63 38.62,22.01 38.49,21.89
  vias: v2(38.49,21.82)
$1N4599: length 3.8
  Top Layer w0.254: 44.41,22.3 42.98,22.3 42.57,21.89 v2(40.77,21.89)
$1N4606: length 6
  Top Layer w0.254: 43.93,29.19 43.93,28 44.41,27.52 44.81,27.52 46.61,25.72 U16.3
$1N4608: length 7.5
  Top Layer w0.254: 41.93,29.19 41.93,27.79 42.7,27.02 44.61,27.02 46.11,25.51 U16.4
$1N4625: length 5
  Top Layer w0.254: 46.3,29.16 46.3,26.74 47.11,25.93 U16.2
$1N4628: length 38.7
  Top Layer w0.254: 78.24,33.94 78.24,34.7 77.99,34.95 v2(60.46,34.95) ; v2(60.46,29.36) 55.73,29.36 50.16,23.8 U16.24
  Bottom Layer w0.254: v2(60.46,34.95) v2(60.46,29.36)
$1N4632: length 31.4
  Top Layer w0.254: 72.83,23.41 v2(71.53,23.41) ; U16.22 51.1,22.8 56.4,28.09 v2(71.51,28.09)
  Bottom Layer w0.254: v2(71.53,23.41) 71.53,28.08 v2(71.51,28.09)
$1N4654: length 17.7
  Top Layer w0.254: U16.21 51.61,22.3 56.14,26.82 64.14,26.82
  vias: v1(64.65,26.7) v1(64.65,25.7) v1(64.65,24.7) v1(64.65,23.7) v1(64.65,22.7) v1(64.65,21.65) v1(64.65,20.65) v1(64.65,19.65) v1(64.65,18.65) v1(65.65,26.7) v1(65.65,25.7) v1(65.65,24.7) v1(65.65,23.7) v1(65.65,22.7) v1(65.65,21.65) v1(65.65,20.65) v1(65.65,19.65) v1(65.65,18.65) v1(66.65,26.7) v1(66.65,25.7) v1(66.65,24.7) v1(66.65,23.7) v1(66.65,22.7) v1(66.65,21.65) v1(66.65,20.65) v1(66.65,19.65) v1(66.65,18.65) v1(67.65,26.7) v1(67.65,25.7) v1(67.65,24.7) v1(67.65,23.7) v1(67.65,22.7) v1(67.65,21.65) v1(67.65,20.65) v1(67.65,19.65) v1(67.65,18.65) v1(68.65,26.7) v1(68.65,25.7) v1(68.65,24.7) v1(68.65,23.7) v1(68.65,22.7) v1(68.65,21.65) v1(68.65,20.65) v1(68.65,19.65) v1(68.65,18.65)
$1N4665: length 26.5
  Top Layer w0.254: 72.83,16.62 55.55,16.62 50.87,21.3 U16.19
$1N4669: length 35.4
  Top Layer w0.254: 78.24,13.11 78.24,13.62 77.48,14.38 51.82,14.38 47.11,19.09 U16.17
$1N4689: length 3
  Top Layer w0.254: U16.15 46.11,20.59 46.11,17.63
$1N4694: length 4.6
  Top Layer w0.254: 43.44,17.63 43.44,18.44 43.95,18.95 45.22,18.95 45.61,19.35 U16.14
$1N8343: length 5.5
  Top Layer w0.254: U19.19 13.86,14.63 14.44,14.05 C33.2 16.34,14.05 17.15,13.24 17.93,13.24 R41.2
$1N8410: length 9.8
  Top Layer w0.254: U19.9 10.23,10.39 10.6,10.01 17.61,10.01 17.98,10.38 R41.1
$1N8467: length 10.4
  Top Layer w0.254: v2(9.28,10.32) 9.28,11.46 9.54,11.73 U19.8 ; R39.1 R40.2
  Bottom Layer w0.254: v2(9.28,10.32) 9.28,10.32 v2(2.86,10.32)
$1N8544: length 2.8
  Top Layer w0.254: R43.2 7.47,13.33 U19.4
$1N8550: length 4.3
  Top Layer w0.254: R42.2 7.77,15.4 8.21,15.4 8.39,15.22 8.39,14.13 8.8,13.73 U19.3
$1N8556: length 6
  Top Layer w0.254: C34.2 5.15,12.55 5.34,12.35 8.15,12.35 8.72,12.93 U19.5
$1N8600: length 2.9
  Top Layer w0.254: C38.2 9.91,16.3 10.23,15.98 U19.1
$1N8605: length 4
  Top Layer w0.254: C38.1 12.5,17.37 11.93,16.8 U19.20
$1N8628: length 7.1
  Top Layer w0.254: U19.7 9.31,12.13 8.64,11.46 8.64,9.42 R45.2 R44.1

## Copper pours and planes (outline as drawn; the poured copper is in the pictures)
+5V on Top Layer: 34.17,17.81 40.77,17.81 40.77,11.08 34.17,11.08
+5V on Top Layer: 22.74,19.85 25.66,19.85 25.66,10.45 22.74,10.45
+5V on PWR: 22.61,24.04 40.9,24.04 40.9,1.05 22.61,1.05
GND on Top Layer: 0.01,70.01 100.01,70.01 100.01,0.01 0.01,0.01
GND on Bottom Layer: 0.01,70.01 100.01,70.01 100.01,0.01 0.01,0.01
GND on GND: 0.01,70.01 100.01,70.01 100.01,0.01 0.01,0.01
VCC on Top Layer: 66.99,40.17 76.46,40.17 76.46,35.76 66.99,35.76
VCC on Top Layer: 19.35,54.3 31.35,54.3 31.35,33.41 19.35,33.41
VCC on Top Layer: 47.56,61.04 67.06,61.04 67.06,51.04 47.56,51.04
VCC on Top Layer: 66.99,34.23 76.46,34.23 76.46,29.83 66.99,29.83
VCC on Top Layer: 47.56,34.23 67.06,34.23 67.06,24.23 47.56,24.23
VCC on Top Layer: 66.99,13.36 76.46,13.36 76.46,8.96 66.99,8.96
VCC on Top Layer: 5.64,63.37 31.35,63.37 31.35,54.16 5.64,54.16
VCC on Top Layer: 66.99,61.04 76.46,61.04 76.46,56.63 66.99,56.63
VCC on Bottom Layer: 19.31,53.37 31.31,53.37 31.31,33.37 19.31,33.37
VCC on PWR: 0.01,70.01 100.01,70.01 100.01,0.01 0.01,0.01
MOTL1 on Top Layer: 74.56,59.72 87.64,59.72 87.64,49.92 74.56,49.92
MOTL1 on Bottom Layer: 74.56,59.72 87.64,59.72 87.64,49.92 74.56,49.92
MOTL1 on PWR: 74.55,59.72 87.63,59.72 87.63,49.93 74.55,49.93
MOTL2 on Top Layer: 74.56,47.53 87.64,47.53 87.64,35.75 74.56,35.75
MOTL2 on Bottom Layer: 74.56,47.52 87.64,47.52 87.64,35.75 74.56,35.75
MOTL2 on PWR: 74.55,47.53 87.63,47.53 87.63,35.75 74.55,35.75
MOTR1 on Top Layer: 74.56,32.92 87.64,32.92 87.64,23.12 74.56,23.12
MOTR1 on Bottom Layer: 74.56,32.91 87.64,32.91 87.64,23.12 74.56,23.12
MOTR1 on PWR: 74.55,32.92 87.63,32.92 87.63,23.12 74.55,23.12
MOTR2 on Top Layer: 74.56,20.72 87.64,20.72 87.64,8.95 74.56,8.95
MOTR2 on Bottom Layer: 74.56,20.72 87.64,20.72 87.64,8.94 74.56,8.94
MOTR2 on PWR: 74.55,20.73 87.63,20.73 87.63,8.95 74.55,8.95
$1N2752 on Top Layer: 63.64,54.31 73.37,54.31 73.37,44.41 63.64,44.41
$1N2752 on Bottom Layer: 63.64,54.31 73.37,54.31 73.37,44.41 63.64,44.41
$1N2752 on PWR: 63.63,54.32 73.37,54.32 73.37,44.41 63.63,44.41
$1N4654 on Top Layer: 63.63,27.51 73.37,27.51 73.37,17.6 63.63,17.6
$1N4654 on Bottom Layer: 63.63,27.51 73.37,27.51 73.37,17.6 63.63,17.6
$1N4654 on PWR: 63.63,27.51 73.37,27.51 73.37,17.61 63.63,17.61
$1N8605 on Top Layer: 12.36,19.72 18.8,19.72 18.8,16.29 12.36,16.29

Small or netless copper shapes (teardrops, artwork), in the pictures only: 125 on Top Layer, 24 on Bottom Layer
